# Altium schematic sheet variantes_revisar.SchDoc
size A
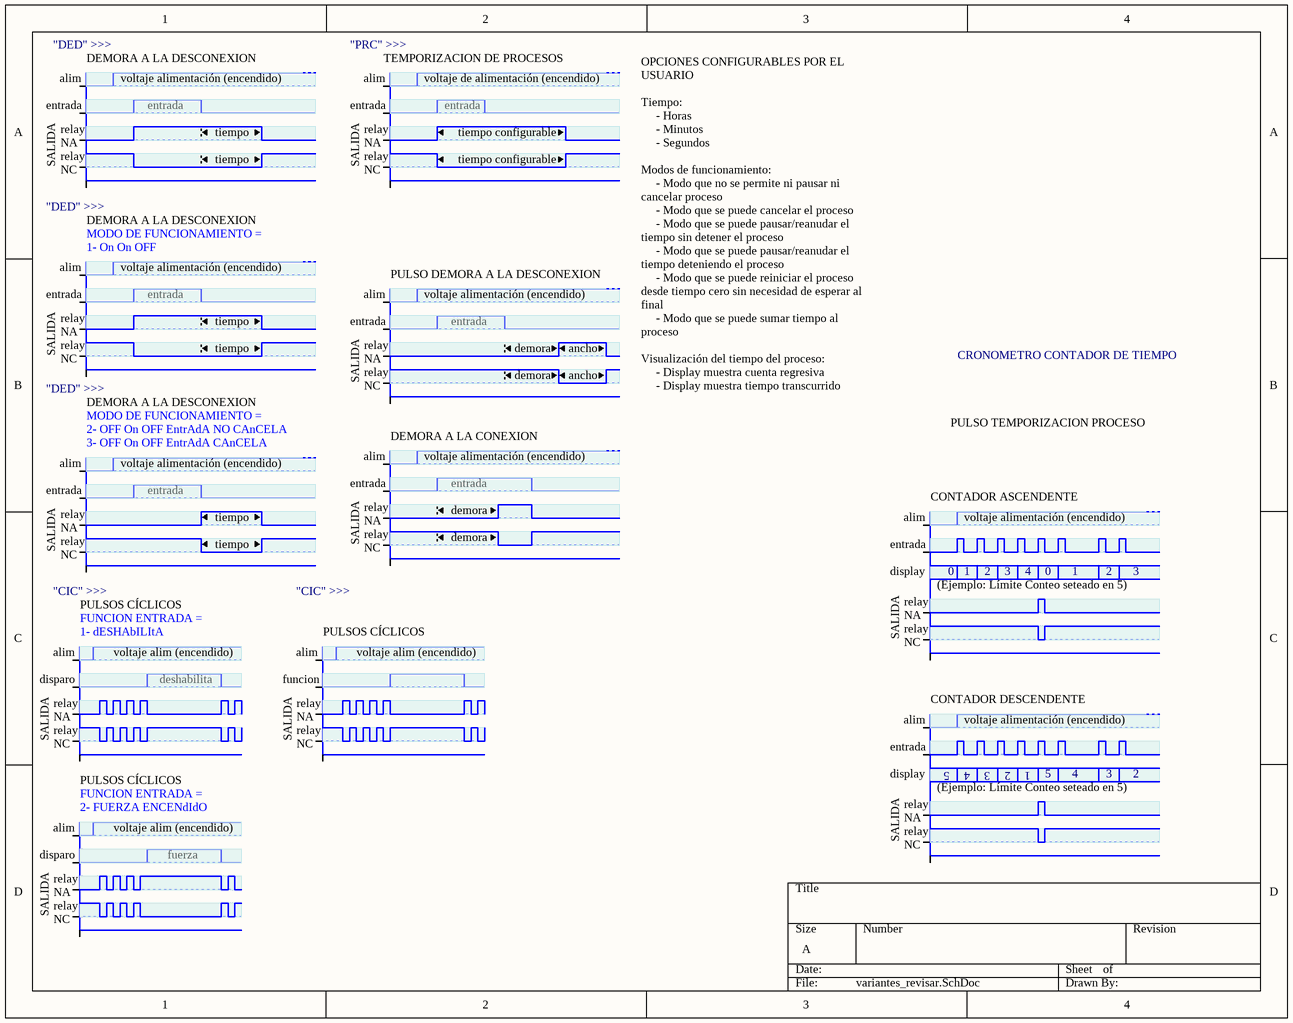
[diagram p0: variantes_revisar.SchDoc]

## Notes on the sheet
- "DED" >>>
- alim
- DEMORA A LA DESCONEXION
- voltaje alimentación (encendido)
- "PRC" >>>
- TEMPORIZACION DE PROCESOS
- voltaje de alimentación (encendido)
- entrada
- relay
  NA
- SALIDA
- tiempo
- tiempo configurable
- relay
  NC
- MODO DE FUNCIONAMIENTO =
- 1- On On OFF
- PULSO DEMORA A LA DESCONEXION
- demora
- ancho
- CRONOMETRO CONTADOR DE TIEMPO
- 2- OFF On OFF EntrAdA NO CAnCELA
- OPCIONES CONFIGURABLES POR EL USUARIO
  Tiempo:
  - Horas
  - Minutos
  - Segundos
  Modos de funcionamiento:
  - Modo que no se permite ni pausar ni cancelar proceso
  - Modo que se puede cancelar el proceso
  - Modo que se puede pausar/reanudar el tiempo sin detener el proceso
  - Modo que se puede pausar/reanudar el tiempo deteniendo el proceso
  - Modo que se puede reiniciar el proceso desde tiempo cero sin necesidad de esperar al final
  - Modo que se puede sumar tiempo al proceso
  Visualización del tiempo del proceso:
  - Display muestra cuenta regresiva
  - Display muestra tiempo transcurrido
- PULSO TEMPORIZACION PROCESO
- 3- OFF On OFF EntrAdA CAnCELA
- DEMORA A LA CONEXION
- CONTADOR ASCENDENTE
- "CIC" >>>
- PULSOS CÍCLICOS
- 1- dESHAbILItA
- FUNCION ENTRADA =
- display
- (Ejemplo: Límite Conteo seteado en 5)
- 0
- 1
- 2
- 3
- 4
- disparo
- voltaje alim (encendido)
- deshabilita
- funcion
- CONTADOR DESCENDENTE
- 5
- 2- FUERZA ENCENdIdO
- fuerza